# Altium schematic sheet Tremolo.SchDoc
size A; DocumentNumber: 2; SheetNumber: 2; SheetTotal: 5
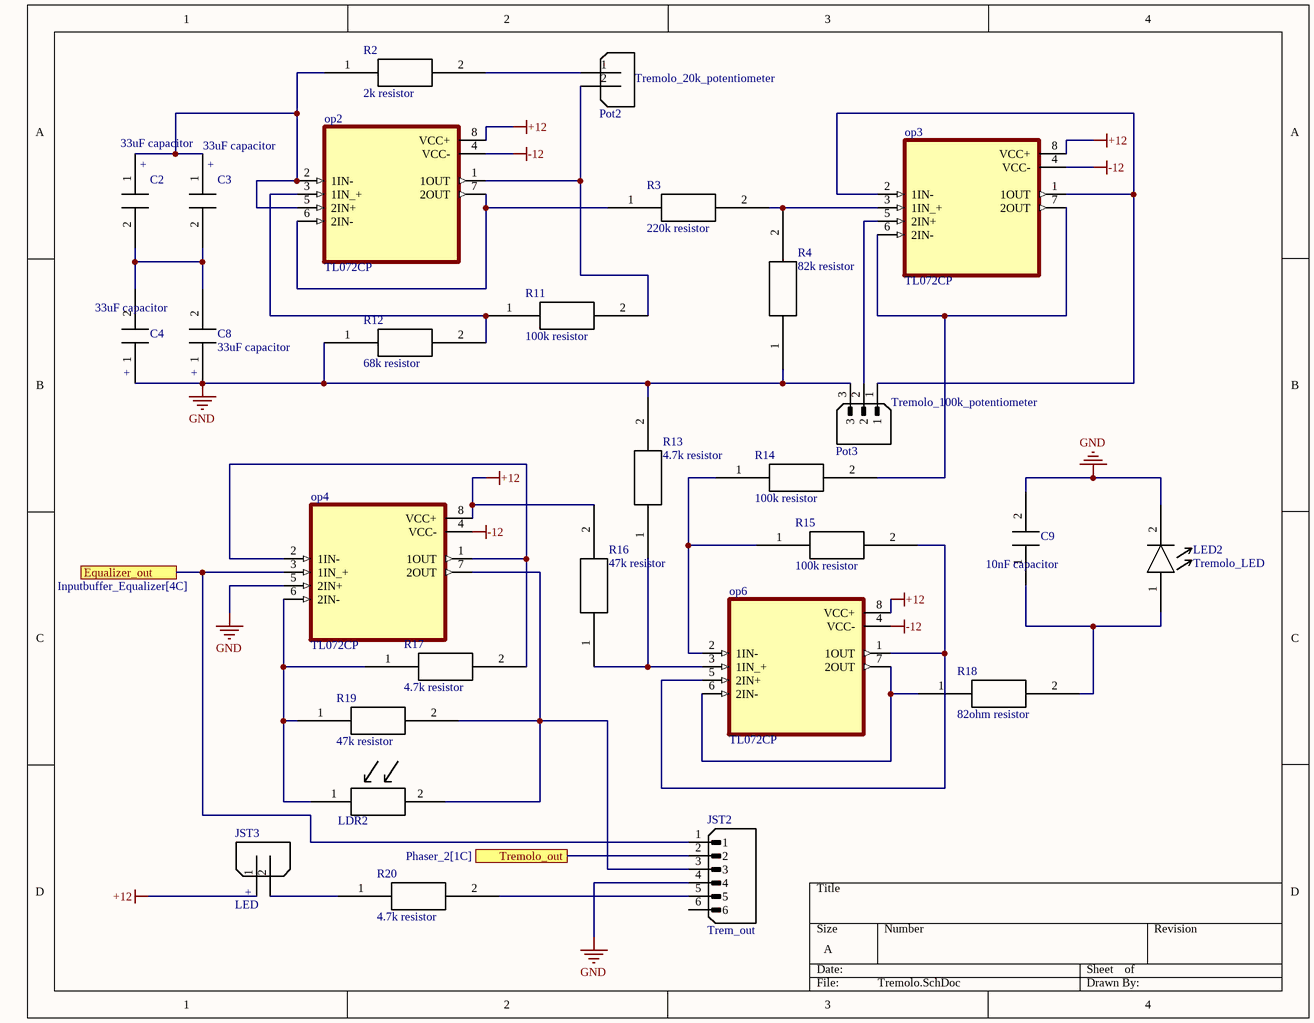
[diagram p0: Tremolo.SchDoc]

## Parts
C2  33uF capacitor  [33uF]
C3  33uF capacitor  [33uF]
C4  33uF capacitor  [33uF]
C8  33uF capacitor  [33uF]
C9  10nF capacitor  [10nF]
JST2  Trem_out  [6pin_JST]
JST3  LED  [2pin_JST]
LDR2  LDR  [LDR]  (value not drawn)
LED2  Tremolo_LED  [LED]
op2  TL072CP  [TL072CP]
op3  TL072CP  [TL072CP]
op4  TL072CP  [TL072CP]
op6  TL072CP  [TL072CP]
Pot2  Tremolo_20k_potentiometer  [2pin_JST_non_polarized]
Pot3  Tremolo_100k_potentiometer  [3pin_jst]
R2  2k resistor  [2k]
R3  220k resistor  [220k]
R4  82k resistor  [82k]
R11  100k resistor  [100k]
R12  68k resistor  [68k]
R13  4.7k resistor  [4.7k]
R14  100k resistor  [100k]
R15  100k resistor  [100k]
R16  47k resistor  [47k]
R17  4.7k resistor  [4.7k]
R18  82ohm resistor  [82]
R19  47k resistor  [47k]
R20  4.7k resistor  [4.7k]

## Ports
Equalizer_out (see Inputbuffer_Equalizer[4C]), Tremolo_out (see Phaser_2[1C])

## Nets
+12: JST3.1 op2.8(VCC+) op3.8(VCC+) op4.8(VCC+) op6.8(VCC+) R16.2
-12: op2.4(VCC-) op3.4(VCC-) op4.4(VCC-) op6.4(VCC-)
GND: C4.1 C8.1 C9.2 JST2.4 LED2.2 op4.5(2IN+) Pot3.3 R4.1 R12.1 R13.2
Equalizer_out: JST2.1 op4.3(1IN_+) ; port Equalizer_out
Tremolo_out: JST2.2 ; port Tremolo_out
NetC2_1: C2.1 C3.1 op2.2(1IN-) op2.5(2IN+) R2.1
NetC2_2: C2.2 C3.2 C4.2 C8.2
NetC9_1: C9.1 LED2.1 R18.2
NetJST2_3: JST2.3 LDR2.2 op4.7(2OUT) R19.2
NetJST2_5: JST2.5 R20.2
NetJST3_2: JST3.2 R20.1
NetLDR2_1: LDR2.1 op4.6(2IN-) R17.1 R19.1
Netop2_1: op2.1(1OUT) Pot2.2 R11.2
Netop2_3: op2.3(1IN_+) R11.1 R12.2
Netop2_6: op2.6(2IN-) op2.7(2OUT) R3.1
Netop3_1: op3.1(1OUT) op3.2(1IN-) Pot3.1
Netop3_3: op3.3(1IN_+) R3.2 R4.2
Netop3_5: op3.5(2IN+) Pot3.2
Netop3_6: op3.6(2IN-) op3.7(2OUT) R14.2
Netop4_1: op4.1(1OUT) op4.2(1IN-) R17.2
Netop6_1: op6.1(1OUT) op6.5(2IN+) R15.2
Netop6_2: op6.2(1IN-) R14.1 R15.1
Netop6_3: op6.3(1IN_+) R13.1 R16.1
Netop6_6: op6.6(2IN-) op6.7(2OUT) R18.1
NetPot2_1: Pot2.1 R2.2

Not connected (* = marked no-connect by the designer): JST2 6

## Notes on the sheet
- (in symbol 2pin_JST) +
- (in symbol 33uF capacitor) +

## Library data of the parts
JST2 = 6pin_JST
JST3 = 2pin_JST
LED2 = LED
Pot2 = 2pin_jst_non_polarized
Pot3 = 3pin_jst